# EAGLE design Mainboard (EAGLE 8.5.1)
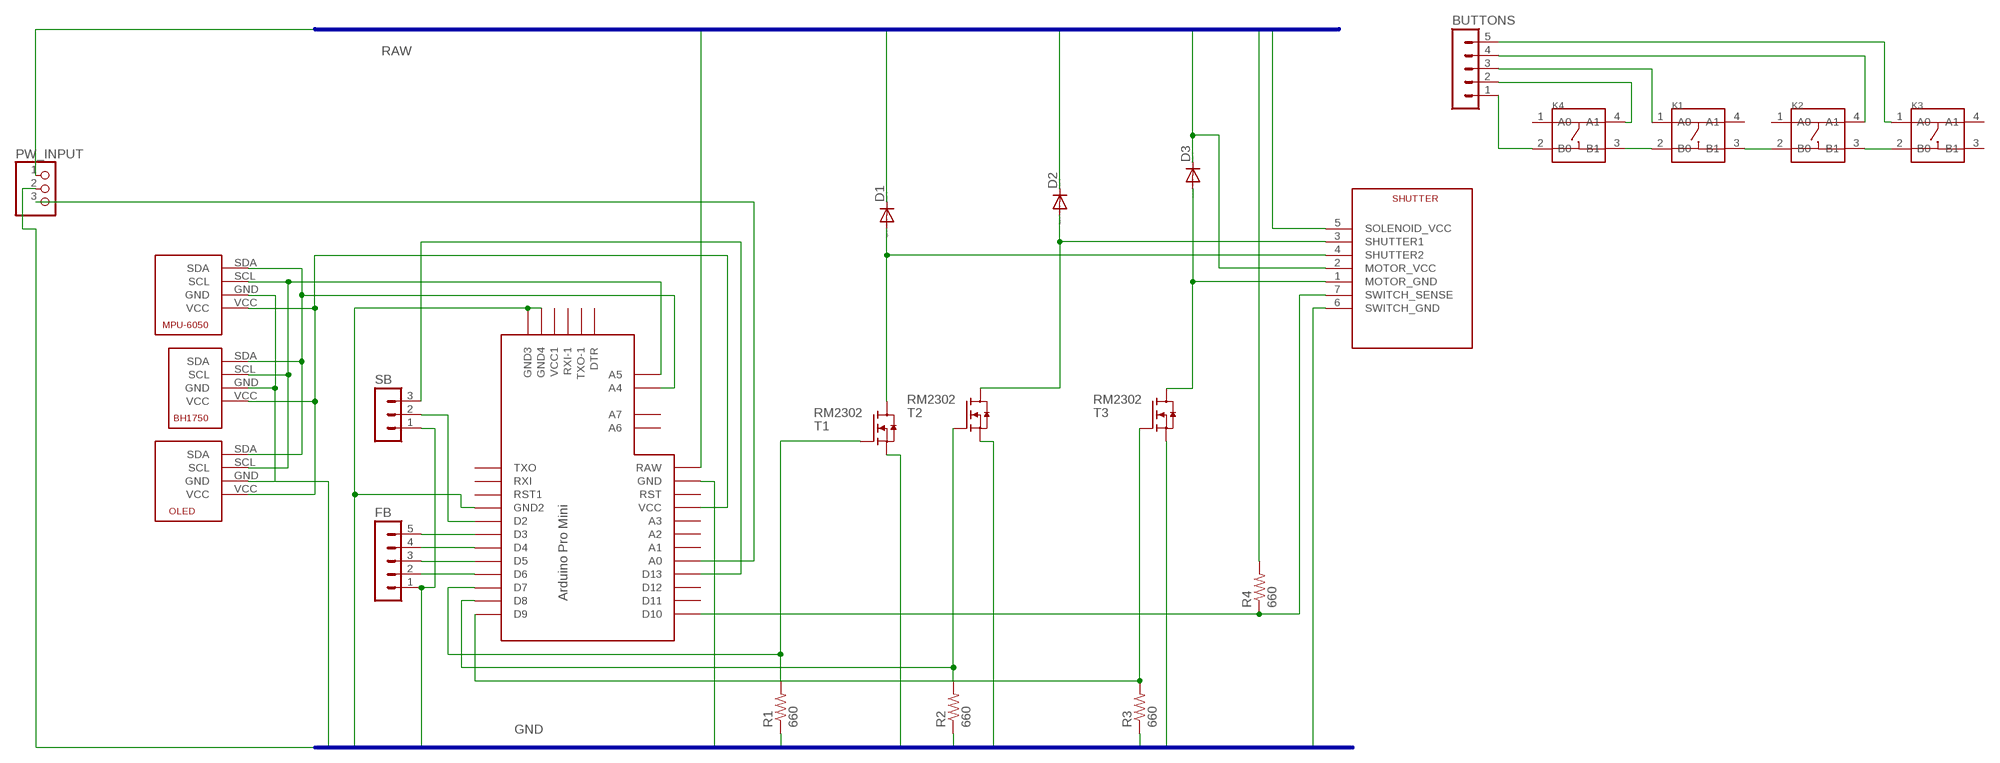
[diagram p0: schematic, sheet 1]

## Parts
BH1750  BH1750  [MA04-1]
BUTTONS  MA05-1  [MA05-1]
D1  DIODE-D-5  [D-5]
D2  DIODE-D-5  [D-5]
D3  DIODE-D-5  [D-5]
FB  MA05-1  [MA05-1]
K1  SMD-SWITCH-TACTILE-SPST-NO(4P-D6.0MM)  [SW4-SMD-6.0X6.0X5.0MM]
K2  SMD-SWITCH-TACTILE-SPST-NO(4P-D6.0MM)  [SW4-SMD-6.0X6.0X5.0MM]
K3  SMD-SWITCH-TACTILE-SPST-NO(4P-D6.0MM)  [SW4-SMD-6.0X6.0X5.0MM]
K4  SMD-SWITCH-TACTILE-SPST-NO(4P-D6.0MM)  [SW4-SMD-6.0X6.0X5.0MM]
MPU6050  MPU-6050  [MA04-1]
OLED  OLED  [MA04-1]
PW_INPUT  PINHD-1X3  [1X03]
R1  660  R-US_0204/2V  [0204V]
R2  660  R-US_0204/2V  [0204V]
R3  660  R-US_0204/2V  [0204V]
R4  660  R-US_0204/2V  [0204V]
SB  MA03-1  [MA03-1]
T1  RM2302  [SOT23]
T2  RM2302  [SOT23]
T3  RM2302  [SOT23]
U$1  SHUTTER  [MA07-1]
U$7  PRO-MINI-2  [PRO-MINI-2]

## Nets
BAT_SENSE: PW_INPUT.3 U$7.A0
BTG: BUTTONS.1 K1.2(B0) K1.3(B1) K2.2(B0) K2.3(B1) K3.2(B0) K4.2(B0) K4.3(B1)
GND: BH1750.GND FB.1 MPU6050.GND OLED.GND PW_INPUT.2 R1.1 R2.1 R3.1 SB.1 T1.SOURCE(S) T2.SOURCE(S) T3.SOURCE(S) U$1.6(SWITCH_GND) U$7.GND U$7.GND1(GND2) U$7.GND2(GND3) U$7.GND3(GND4)
M_GND: D3.A T3.DRAIN(D) U$1.1(MOTOR_GND)
N$1: R3.2 T3.GATE(G) U$7.D9
N$2: R2.2 T2.GATE(G) U$7.D8
N$3: R1.2 T1.GATE(G) U$7.D7
N$14: BUTTONS.2 K4.4(A1)
N$15: BUTTONS.3 K1.1(A0)
N$16: BUTTONS.4 K2.4(A1)
N$17: FB.2 U$7.D6
N$18: FB.3 U$7.D5
N$19: FB.4 U$7.D4
N$20: FB.5 U$7.D3
N$21: BUTTONS.5 K3.1(A0)
N$22: SB.2 U$7.D2
N$23: SB.3 U$7.D13
N$24: BH1750.VCC MPU6050.VCC OLED.VCC U$7.VCC
S1: D2.A T2.DRAIN(D) U$1.3(SHUTTER1)
S2: D1.A T1.DRAIN(D) U$1.4(SHUTTER2)
SCL: BH1750.SCL MPU6050.SCL OLED.SCL U$7.A5
SDA: BH1750.SDA MPU6050.SDA OLED.SDA U$7.A4
SENSE: R4.1 U$1.7(SWITCH_SENSE) U$7.D10
VCC: D1.C D2.C D3.C PW_INPUT.1 R4.2 U$1.2(MOTOR_VCC) U$1.5(SOLENOID_VCC) U$7.RAW
Unconnected: K1.4(A1) K2.1(A0) K3.3(B1) K3.4(A1) K4.1(A0) U$7.A1 U$7.A2 U$7.A3 U$7.A6 U$7.A7 U$7.D11 U$7.D12 U$7.DTR U$7.RST U$7.RST1 U$7.RXI U$7.RXI-1 U$7.TXO U$7.TXO-1 U$7.VCC1

## Buses
GND
RAW

## Library data of the parts
BH1750 = infineon:BH1750
BUTTONS FB = con-lstb:MA05-1: PIN HEADER; OC_FARNELL: unknown; OC_NEWARK: unknown
D1-D3 = diode:DIODE-: DIODE
K1-K4 = Seeed-Switch:SMD-SWITCH-TACTILE-SPST-NO(4P-D6.0MM): 311020004; MPN: DTSM-62K-S-V-T/R(SN431)
MPU6050 = infineon:MPU-6050
OLED = infineon:OLED
PW_INPUT = pinhead:PINHD-1X3: PIN HEADER
R1-R4 = rcl:R-US_: RESISTOR, American symbol
SB = con-lstb:MA03-1: PIN HEADER; OC_FARNELL: unknown; OC_NEWARK: unknown
T1-T3 = infineon:RM2302: N Channel Enhancement mode 20V 4A Mosfet.
U$1 = infineon:SHUTTER
U$7 = Arduino-clone:PRO-MINI-2: Arduino Pro Mini Layout 2 Sparkfun.com

## Board
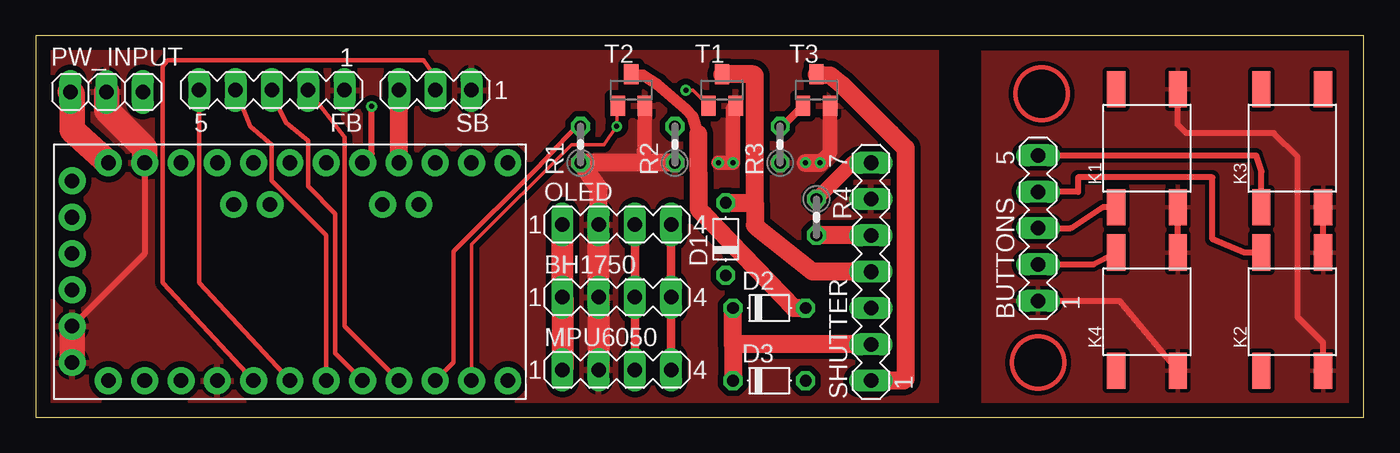
[diagram p1: board, top side]
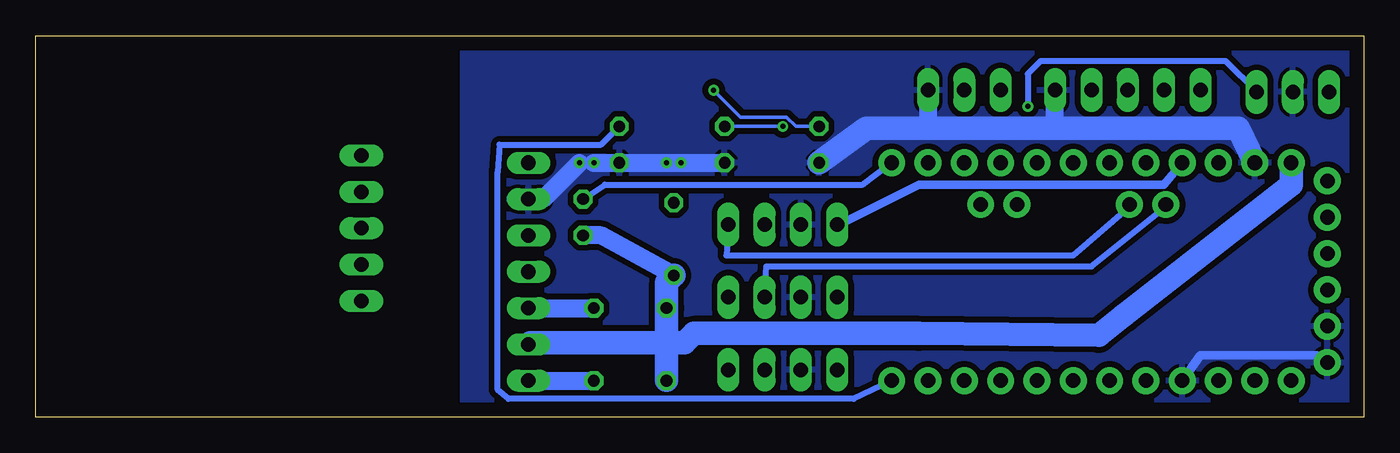
[diagram p2: board, bottom side, seen from below]

Size 92.89 x 26.66 mm. Coordinates in mm from the lower left corner, seen from the top.
Outline: 0,0 92.89,0 92.89,26.66 0,26.66 0,0
Copper layers (1*16): Top 0.035mm / dielectric 1.5mm / Bottom 0.035mm
Design rules "default": minimum track width 6mil, minimum drill 0.35mm, track to track 6mil, track to pad 6mil, pad to pad 6mil, via to via 6mil, smd to smd 6mil, copper to edge 40mil, drill to drill 6mil, minimum pad ring 10mil, minimum via ring 8mil, stop-mask expansion 4mil, vias tented up to drill 0mil, thermal gap 10mil

### Footprints (pad centres in the part's own frame; a part is rotated, then mirrored left to right if it is on the bottom)
MA04-1 = drill 1.016 long: GND -1.27,0; SCL 1.27,0; SDA 3.81,0; VCC -3.81,0
MA05-1 = drill 1.016 long: 1 -5.08,0; 2 -2.54,0; 3 0,0; 4 2.54,0; 5 5.08,0
D-5 = drill 0.813 octagon: A 2.54,0; C -2.54,0
SW4-SMD-6.0X6.0X5.0MM = smd 2.54 x 1.27: 1 -4.129,2.159; 2 -4.129,-2.159; 3 4.129,-2.159; 4 4.129,2.159
1X03 = drill 1.016 long: 1 -2.54,0; 2 0,0; 3 2.54,0
0204V = drill 0.813 octagon: 1 -1.27,0; 2 1.27,0
MA03-1 = drill 1.016 long: 1 -2.54,0; 2 0,0; 3 2.54,0
SOT23 = smd 1 x 1.4: DRAIN 0,1.1; GATE -0.95,-1.1; SOURCE 0.95,-1.1
MA07-1 = drill 1.016 long: 1 -7.62,0; 2 -5.08,0; 3 -2.54,0; 4 0,0; 5 2.54,0; 6 5.08,0; 7 7.62,0
PRO-MINI-2 = drill 1.016 pad 1.88: A0 6.35,-5.08; A1 6.35,-2.54; A2 6.35,0; A3 6.35,2.54; A4 3.429,1.397; A5 3.429,3.937; A6 3.429,-9.017; A7 3.429,-6.477; D2 -8.89,2.54; D3 -8.89,0; D4 -8.89,-2.54; D5 -8.89,-5.08; D6 -8.89,-7.62; D7 -8.89,-10.16; D8 -8.89,-12.7; D9 -8.89,-15.24; D10 6.35,-15.24; D11 6.35,-12.7; D12 6.35,-10.16; D13 6.35,-7.62; DTR 5.08,15.24; GND 6.35,10.16; GND1 -8.89,5.08; GND2 -7.62,15.24; GND3 -5.08,15.24; RAW 6.35,12.7; RST 6.35,7.62; RST1 -8.89,7.62; RXI -8.89,10.16; RXI-1 0,15.24; TXO -8.89,12.7; TXO-1 2.54,15.24; VCC 6.35,5.08; VCC1 -2.54,15.24

### Placement (x,y rotation side)
BH1750  40.64,8.38 0 top
BUTTONS  70.1,13.21 90 top
D1  48.26,12.45 90 top
D2  51.31,7.62 0 top
D3  51.31,2.54 0 top
FB  16.51,22.86 180 top
K1  77.72,18.8 90 top
K2  87.88,7.37 90 top
K3  87.88,18.8 90 top
K4  77.72,7.37 90 top
MPU6050  40.64,3.3 0 top
OLED  40.64,13.46 0 top
PW_INPUT  4.95,22.73 0 top
R1  38.1,19.05 90 top
R2  44.7,19.05 90 top
R3  52.07,19.05 90 top
R4  54.61,13.97 270 top
SB  27.94,22.86 180 top
T1  48.01,22.86 0 top
T2  41.66,22.86 0 top
T3  54.61,22.86 0 top
U$1  58.42,10.16 90 top
U$7  17.78,11.43 90 top

### Tracks (layer width: path | path; a pad name or v marks a point on that pad's centre or on a via)
BAT_SENSE  (via drill 0.35)
  Top 0.406: U$7.A0 23.5,18.41 v23.5,21.72
  Bottom 0.406: PW_INPUT.3 9.65,24.89 22.61,24.89 23.5,24 v23.5,21.72
BTG
  Top 0.152: 79.63,3.56 K4.2 | 79.74,14.49 K1.2
  Top 0.406: BUTTONS.1 75.81,8.13 79.68,3.49 | K4.3 79.88,14.35 79.74,14.49 | K2.2 90.04,5.21 88.27,6.99 88.27,18.2 86.61,19.86 80.47,19.86 79.88,20.45 K1.3 | K2.3 K3.2
  pour Top (isolate 0.305): 66.29,25.65 66.29,0.51 92.2,0.51 92.2,25.65
GND  (via drill 0.35)
  Top 0.406: U$7.GND 7.62,11.43 U$7.GND3
  Top 1.016: 42.55,17.78 T2.SOURCE | T1.SOURCE 48.77,21.57 v48.77,17.78 v47.75,17.78 | T3.SOURCE 55.56,18.48 v54.86,17.78
  Top 1.27: OLED.GND 39.37,16 R1.1 42.55,17.78 R2.1 | v53.85,17.78 v54.86,17.78
  Top 1.524: MPU6050.GND BH1750.GND OLED.GND
  Top 1.778: U$7.GND3 U$7.GND2 | U$7.GND 7.62,18.8 4.95,21.46 PW_INPUT.2
  Bottom 0.61: U$7.GND1 11.43,4.32 3.3,4.32 3.05,3.81 U$7.GND2
  Bottom 1.27: R2.1 v47.75,17.78 v48.77,17.78 R3.1 v53.85,17.78 | U$1.6 57.4,15.24 v54.86,17.78 | SB.1 30.48,20.19 | 21.59,20.19 FB.1
  Bottom 1.651: U$7.GND 8.76,20.19 21.59,20.19 30.48,20.19 34.8,20.19 R1.1
  pour Top (isolate 0.406): 0.51,26.16 0.51,0.51 62.99,0.51 62.99,26.16
  pour Bottom (isolate 0.406): 62.99,0.51 62.99,26.16 0.51,26.16 0.51,0.51
M_GND
  Top 1.27: U$1.1 60.71,2.54 60.83,2.67 60.83,18.8 59.82,19.81 56.39,23.25 55.58,23.88 T3.DRAIN
  Bottom 1.27: U$1.1 D3.A
N$1
  Top 0.508: R3.2 52.22,20.32 T3.GATE
  Bottom 0.406: R3.2 53.34,19.05 60.45,19.05 60.58,17.14 60.58,1.91 59.82,1.27 35.69,1.27 U$7.D9
N$2  (via drill 0.35)
  Top 0.254: U$7.D8 30.48,12.06 37.47,19.05 39.75,19.05 v40.64,20.32 T2.GATE
  Bottom 0.254: v40.64,20.32 R2.2
N$3  (via drill 0.35)
  Top 0.254: v45.47,22.86 45.96,22.86 T1.GATE
  Top 0.305: R1.2 37.85,20.32 37.08,19.56 35.05,17.41 29.23,11.59 29.23,3.83 U$7.D7
  Bottom 0.254: R1.2 39.71,20.32 40.37,20.98 43.58,20.98 v45.47,22.86
N$14
  Top 0.406: BUTTONS.2 73.98,10.67 K4.4
N$15
  Top 0.406: K1.1 74.61,14.67 72.39,13.21 BUTTONS.3
N$16
  Top 0.406: BUTTONS.4 72.9,15.75 72.9,16.76 82.3,16.76 82.3,12.45 84.52,11.49 85.6,11.49
  Top 1.016: K2.4 85.6,11.49
N$17
  Top 0.305: FB.2 21.59,19.56 21.59,6.35 U$7.D6
N$18
  Top 0.305: FB.3 16.51,22.61 17.53,20.57 19.05,19.3 19.05,16.13 20.95,14.22 20.95,4.45 U$7.D5
N$19
  Top 0.305: FB.4 14.99,20.32 16.51,19.05 16.51,16.51 20.32,12.7 U$7.D4
N$20
  Top 0.305: FB.5 11.43,9.4 U$7.D3
N$21
  Top 0.406: K3.1 85.72,17.14 85.34,18.29 BUTTONS.5
N$22
  Top 0.305: U$7.D2 8.89,9.4 8.89,24.51 9.22,24.94 27.11,24.94 27.69,24.13 27.67,22.86 SB.2
N$23
  Top 1.27: U$7.D13 SB.3
N$24
  Top 1.524: MPU6050.VCC BH1750.VCC OLED.VCC
  Bottom 0.61: U$7.VCC 13.97,16.26 31.11,16.26 36.7,13.46 OLED.VCC
S1
  Top 0.813: 46.33,19.79 45.95,21.04 45.48,21.51 43.45,23.28 43.46,23.27 42.47,23.91 T2.DRAIN
  Top 1.27: D2.A 53.02,7.62 46.75,14.15 46.37,14.54 46.33,19.79
  Bottom 1.27: U$1.3 D2.A
S2
  Top 1.27: U$1.4 54.36,10.16 50.48,13.22 50.29,13.42 50.29,14.99 | D1.A 50.29,14.99 | 50.29,14.99 50.29,15.75 50.29,23.88 50.21,23.96 T1.DRAIN
SCL
  Top 0.61: MPU6050.SCL BH1750.SCL OLED.SCL
  Bottom 0.152: 13.97,14.61 U$7.A5
  Bottom 0.406: 13.97,14.61 19.05,10.54 41.78,10.54 BH1750.SCL
SDA
  Top 0.61: MPU6050.SDA BH1750.SDA OLED.SDA
  Bottom 0.152: 16.51,14.61 U$7.A4
  Bottom 0.406: 16.51,14.61 20.32,11.3 44.58,11.3 OLED.SDA
SENSE
  Top 1.016: U$1.7 57.15,17.78 R4.1
  Bottom 0.406: U$7.D10 35.05,16.26 53.09,16.26 R4.1
VCC
  Top 1.27: U$1.5 R4.2 | U$1.2 48.77,5.08 | 48.77,5.08 D3.C | 48.77,5.08 D2.C
  Top 1.778: U$7.RAW 2.54,20.07 2.54,22.61 PW_INPUT.1
  Bottom 1.27: D1.C 53.34,12.7 R4.2 | 58.29,5.21 U$1.2
  Bottom 1.651: U$7.RAW 5.08,16.26 16.76,7.11 18.54,5.71 31.11,5.84 46.86,5.84 47.5,5.21 58.29,5.21 | 48.77,2.58 D2.C 48.77,9.4 D1.C
(copper drawn outside any net)
  shapes: Top circle x2